# Altium schematic sheet RF-Remute-FT-V1.1.SchDoc
size C; SheetNumber: 1; SheetTotal: 1
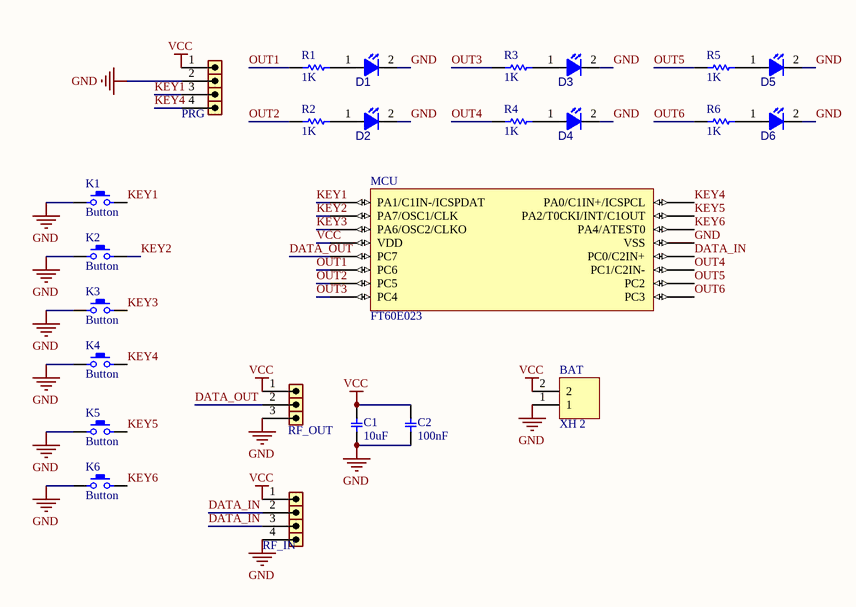
[diagram p0: RF-Remute-FT-V1.1.SchDoc]

## Parts
BAT  XH 2  [XH 2 PIN ( White )]
C1  value 10uF  [C0805]  (hidden comment: Capacitor SMD 0805)
C2  value 100nF  [C0805]  (hidden comment: Capacitor SMD 0805)
D1  LED SMD 0805  [LED SMD 0805 (Green)]  (value not drawn)
D2  LED SMD 0805  [LED SMD 0805 (Green)]  (value not drawn)
D3  LED SMD 0805  [LED SMD 0805 (Green)]  (value not drawn)
D4  LED SMD 0805  [LED SMD 0805 (Green)]  (value not drawn)
D5  LED SMD 0805  [LED SMD 0805 (Green)]  (value not drawn)
D6  LED SMD 0805  [LED SMD 0805 (Green)]  (value not drawn)
K1  Button  [BUTTON]
K2  Button  [BUTTON]
K3  Button  [BUTTON]
K4  Button  [BUTTON]
K5  Button  [BUTTON]
K6  Button  [BUTTON]
MCU  FT60E023  [SSOP-16]
PRG  Female Header Single 4  [HDR_F_1X4]  (value not drawn)
R1  value 1K  [R0805]  (hidden comment: Resistor SMD 0805)
R2  value 1K  [R0805]  (hidden comment: Resistor SMD 0805)
R3  value 1K  [R0805]  (hidden comment: Resistor SMD 0805)
R4  value 1K  [R0805]  (hidden comment: Resistor SMD 0805)
R5  value 1K  [R0805]  (hidden comment: Resistor SMD 0805)
R6  value 1K  [R0805]  (hidden comment: Resistor SMD 0805)
RF_IN  Female Header Single 4  [HDR_F_1X4]  (value not drawn)
RF_OUT  Female Header Single 3  [HDR_F_1X3]  (value not drawn)

## Nets
GND: BAT.1 C1.1 C2.1 D1.2(CATHODE) D2.2(CATHODE) D3.2(CATHODE) D4.2(CATHODE) D5.2(CATHODE) D6.2(CATHODE) K1.1 K2.1 K3.1 K4.1 K5.1 K6.1 MCU.13(VSS) PRG.2 RF_IN.4 RF_OUT.3
VCC: BAT.2 C1.2 C2.2 MCU.4(VDD) PRG.1 RF_IN.1 RF_OUT.1
DATA_IN: MCU.12(PC0/C2IN+) RF_IN.2 RF_IN.3
DATA_OUT: MCU.5(PC7) RF_OUT.2
KEY1: K1.2 MCU.1(PA1/C1IN-/ICSPDAT) PRG.3
KEY2: K2.2 MCU.2(PA7/OSC1/CLK)
KEY3: K3.2 MCU.3(PA6/OSC2/CLKO)
KEY4: K4.2 MCU.16(PA0/C1IN+/ICSPCL) PRG.4
KEY5: K5.2 MCU.15(PA2/T0CKI/INT/C1OUT)
KEY6: K6.2 MCU.14(PA4/ATEST0)
OUT1: MCU.6(PC6) R1.2
OUT2: MCU.7(PC5) R2.2
OUT3: MCU.8(PC4) R3.2
OUT4: MCU.11(PC1/C2IN-) R4.2
OUT5: MCU.10(PC2) R5.2
OUT6: MCU.9(PC3) R6.2
NetD1_1: D1.1(ANODE) R1.1
NetD2_1: D2.1(ANODE) R2.1
NetD3_1: D3.1(ANODE) R3.1
NetD4_1: D4.1(ANODE) R4.1
NetD5_1: D5.1(ANODE) R5.1
NetD6_1: D6.1(ANODE) R6.1

## Library data of the parts
BAT = Conector XH 2 Pin: ComponentLink1Description: Tarahiboard; ComponentLink1URL: https://www.tarahiboard.com/product/library-pack; DatasheetVersion: 2022
C1 C2 = Capacitor SMD 0805: Capacitor C SMD 0805; DatasheetVersion: 2022; ComponentLink1Description: Tarahiboard; ComponentLink1URL: https://www.tarahiboard.com
K1-K6 = BUTTON-6.3.4-SMD: Manufacturer: Panasonic; Manufacturer Part Number: EVQ-PE605T; Mechanical Life: 30000Cycles; Actuator Color: Brown; Voltage Rating (DC): 12V; Throw Configuration: SPST; Contact Resistance: 100mR; Operating Force: 2.4N; Current Rating: 50mA; Illumination Type: Non-Illuminated,Illuminated; Switch Travel: 0.25mm; Switch Function: Off-Mom; Actuator Type: Standard; Actuator Length: 1.5mm; Supplier 1: Digi-Key; RoHS: Yes; Category: Tactile Switches; Stock 1: 1845; Pricing 1: 1=0.42000, 10=0.41000, 25=0.38600, 100=0.33510, 250=0.30400, 500=0.28280, 1000=0.25452, 2500=0.23897, 5000=0.22200 (USD); Mount: Through Hole; Contact Plating: Silver; Min Operating Temperature: -30°C; Max Operating Temperature: 85°C; Packaging: Bulk; Package Quantity: 1000; Max Voltage Rating (DC): 12V; Contact Current Rating: 50mA; Termination: PC Pin; Electrical Life: 30000Cycles; Orientation: Straight; Series: EVQPE; Size: 3.5mm; REACH SVHC: No SVHC; Lead Free: Lead Free; RoHS Compliant: Yes; ComponentLink1URL: https://datasheet.ciiva.com/25603/0900766b810ad3e5-25603911.pdf?src-supplier=RSComponents; ComponentLink1Description: https://datasheet.ciiva.com/25603/0900766b810ad3e5-25603911.pdf?src-supplier=RSComponents; ComponentLink2URL: https://datasheet.ciiva.com/30091/atv0000ce8-30091136.pdf?src-supplier=Onlinecomponents.com; ComponentLink2Description: https://datasheet.ciiva.com/30091/atv0000ce8-30091136.pdf?src-supplier=Onlinecomponents.com; ComponentLink3URL: https://datasheet.ciiva.com/16377/atk0000ce35-16377527.pdf?src-supplier=Future+Electronics; ComponentLink3Description: https://datasheet.ciiva.com/16377/atk0000ce35-16377527.pdf?src-supplier=Future+Electronics; ComponentLink4URL: https://datasheet.ciiva.com/16155/atv0000ce8-16155306.pdf?src-supplier=Onlinecomponents.com; ComponentLink4Description: https://datasheet.ciiva.com/16155/atv0000ce8-16155306.pdf?src-supplier=Onlinecomponents.com; Supplier Part Number 1: P13592S-ND; Supplier 2: Digi-Key
PRG RF_IN = Female Header Single 4: Female, pitch: 2.54mm; ComponentLink1Description: Tarahiboard; ComponentLink1URL: https://www.tarahiboard.com/product/library-pack; DatasheetVersion: 2022
RF_OUT = Female Header Single 3: Female, pitch: 2.54mm; ComponentLink1Description: Tarahiboard; ComponentLink1URL: https://www.tarahiboard.com/product/library-pack; DatasheetVersion: 2022
D1-D6 = LED SMD 0805: ComponentLink1Description: Tarahiboard; ComponentLink1URL: https://www.tarahiboard.com/product/library-pack; DatasheetVersion: 2022
R1-R6 = Resistor SMD 0805: DatasheetVersion: 2022; ComponentLink1Description: Website: Tarahiboard; ComponentLink1URL: https://www.tarahiboard.com/product/library-pack